# EAGLE schematic final_sdr (EAGLE 8.5.0)

## Sheet 1 of 2
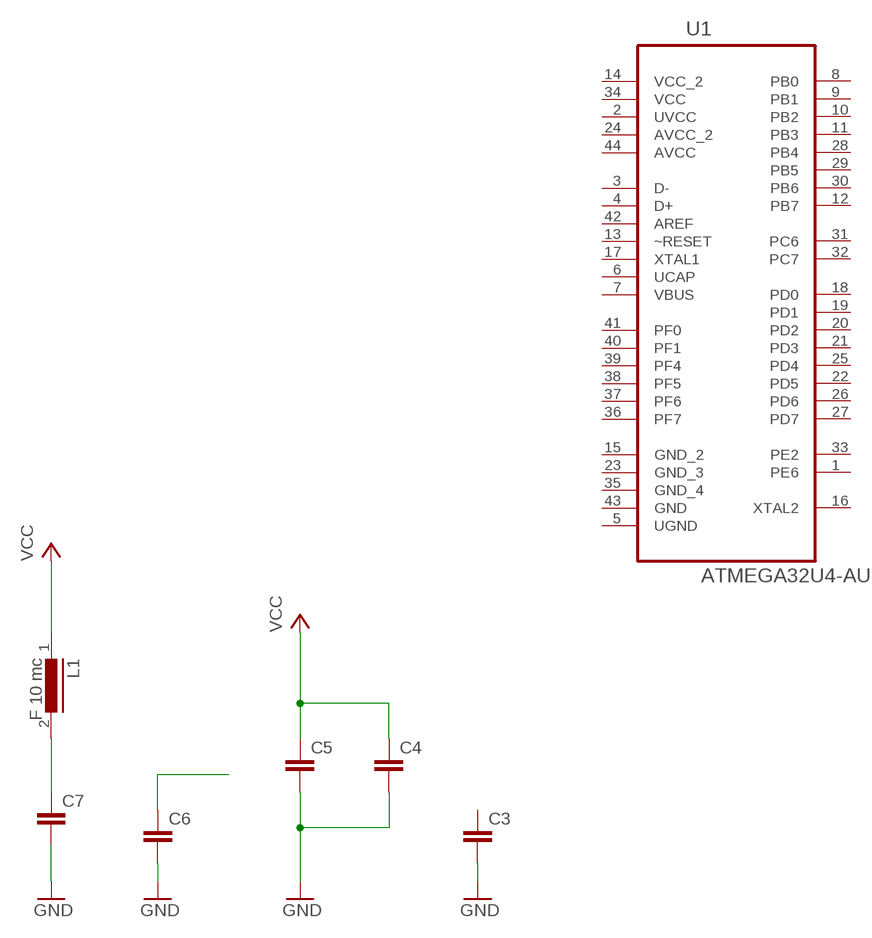
[diagram p0: schematic, sheet 1]

### Parts
C3  C2.5/2  [C2.5-2]
C4  C2.5/2  [C2.5-2]
C5  C2.5/2  [C2.5-2]
C6  C2.5/2  [C2.5-2]
C7  C2.5/2  [C2.5-2]
L1  F 10 mc  B825-35  [B825-35]
U1  ATMEGA32U4-AU  [QFP80P1200X1200X120-44N]

### Nets
GND: C3.2 C4.2 C5.2 C6.2 C7.2
N$1: C6.1
N$3: C7.1 L1.2
VCC: C4.1 C5.1 L1.1
Unconnected: C3.1 U1.1(PE6) U1.3(D-) U1.4(D+) U1.5(UGND) U1.7(VBUS) U1.8(PB0) U1.9(PB1) U1.10(PB2) U1.11(PB3) U1.12(PB7) U1.13(~RESET) U1.15(GND_2) U1.16(XTAL2) U1.17(XTAL1) U1.18(PD0) U1.19(PD1) U1.20(PD2) U1.21(PD3) U1.22(PD5) U1.23(GND_3) U1.25(PD4) U1.26(PD6) U1.27(PD7) U1.28(PB4) U1.29(PB5) U1.30(PB6) U1.31(PC6) U1.32(PC7) U1.33(PE2) U1.35(GND_4) U1.36(PF7) U1.37(PF6) U1.38(PF5) U1.39(PF4) U1.40(PF1) U1.41(PF0) U1.42(AREF) U1.43(GND)

## Sheet 2 of 2
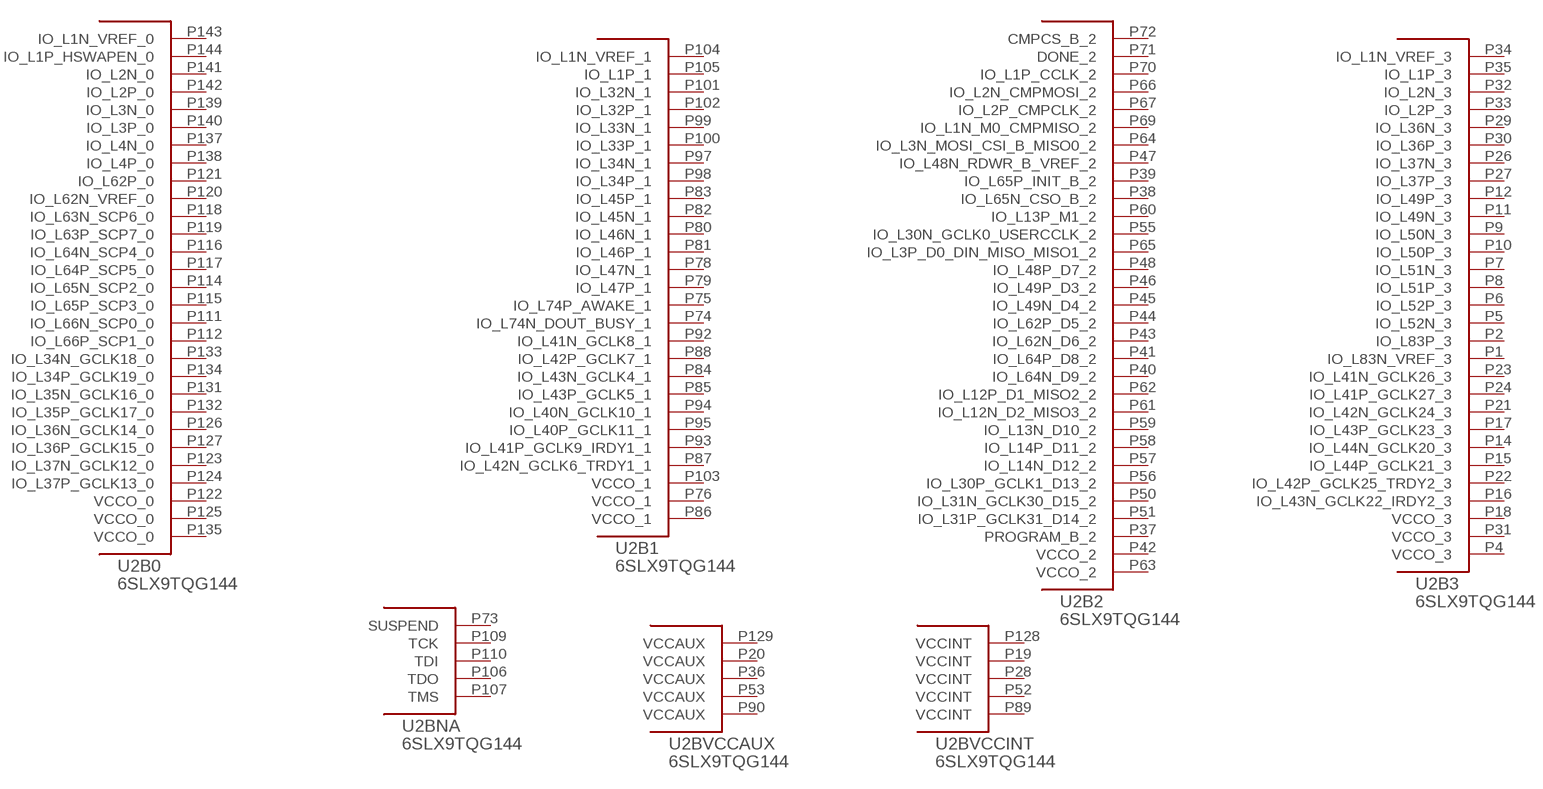
[diagram p1: schematic, sheet 2]

### Parts
U2  6SLX9TQG144  [TQ144]
Unconnected: U2.P1(B3:IO_L83N_VREF_3) U2.P2(B3:IO_L83P_3) U2.P4(B3:VCCO_3) U2.P5(B3:IO_L52N_3) U2.P6(B3:IO_L52P_3) U2.P7(B3:IO_L51N_3) U2.P8(B3:IO_L51P_3) U2.P9(B3:IO_L50N_3) U2.P10(B3:IO_L50P_3) U2.P11(B3:IO_L49N_3) U2.P12(B3:IO_L49P_3) U2.P14(B3:IO_L44N_GCLK20_3) U2.P15(B3:IO_L44P_GCLK21_3) U2.P16(B3:IO_L43N_GCLK22_IRDY2_3) U2.P17(B3:IO_L43P_GCLK23_3) U2.P18(B3:VCCO_3) U2.P19(BVCCINT:VCCINT) U2.P20(BVCCAUX:VCCAUX) U2.P21(B3:IO_L42N_GCLK24_3) U2.P22(B3:IO_L42P_GCLK25_TRDY2_3) U2.P23(B3:IO_L41N_GCLK26_3) U2.P24(B3:IO_L41P_GCLK27_3) U2.P26(B3:IO_L37N_3) U2.P27(B3:IO_L37P_3) U2.P28(BVCCINT:VCCINT) U2.P29(B3:IO_L36N_3) U2.P30(B3:IO_L36P_3) U2.P31(B3:VCCO_3) U2.P32(B3:IO_L2N_3) U2.P33(B3:IO_L2P_3) U2.P34(B3:IO_L1N_VREF_3) U2.P35(B3:IO_L1P_3) U2.P36(BVCCAUX:VCCAUX) U2.P37(B2:PROGRAM_B_2) U2.P38(B2:IO_L65N_CSO_B_2) U2.P39(B2:IO_L65P_INIT_B_2) U2.P40(B2:IO_L64N_D9_2) U2.P41(B2:IO_L64P_D8_2) U2.P42(B2:VCCO_2) U2.P43(B2:IO_L62N_D6_2) U2.P44(B2:IO_L62P_D5_2) U2.P45(B2:IO_L49N_D4_2) U2.P46(B2:IO_L49P_D3_2) U2.P47(B2:IO_L48N_RDWR_B_VREF_2) U2.P48(B2:IO_L48P_D7_2) U2.P50(B2:IO_L31N_GCLK30_D15_2) U2.P51(B2:IO_L31P_GCLK31_D14_2) U2.P52(BVCCINT:VCCINT) U2.P53(BVCCAUX:VCCAUX) U2.P55(B2:IO_L30N_GCLK0_USERCCLK_2) U2.P56(B2:IO_L30P_GCLK1_D13_2) U2.P57(B2:IO_L14N_D12_2) U2.P58(B2:IO_L14P_D11_2) U2.P59(B2:IO_L13N_D10_2) U2.P60(B2:IO_L13P_M1_2) U2.P61(B2:IO_L12N_D2_MISO3_2) U2.P62(B2:IO_L12P_D1_MISO2_2) U2.P63(B2:VCCO_2) U2.P64(B2:IO_L3N_MOSI_CSI_B_MISO0_2) U2.P65(B2:IO_L3P_D0_DIN_MISO_MISO1_2) U2.P66(B2:IO_L2N_CMPMOSI_2) U2.P67(B2:IO_L2P_CMPCLK_2) U2.P69(B2:IO_L1N_M0_CMPMISO_2) U2.P70(B2:IO_L1P_CCLK_2) U2.P71(B2:DONE_2) U2.P72(B2:CMPCS_B_2) U2.P73(BNA:SUSPEND) U2.P74(B1:IO_L74N_DOUT_BUSY_1) U2.P75(B1:IO_L74P_AWAKE_1) U2.P76(B1:VCCO_1) U2.P78(B1:IO_L47N_1) U2.P79(B1:IO_L47P_1) U2.P80(B1:IO_L46N_1) U2.P81(B1:IO_L46P_1) U2.P82(B1:IO_L45N_1) U2.P83(B1:IO_L45P_1) U2.P84(B1:IO_L43N_GCLK4_1) U2.P85(B1:IO_L43P_GCLK5_1) U2.P86(B1:VCCO_1) U2.P87(B1:IO_L42N_GCLK6_TRDY1_1) U2.P88(B1:IO_L42P_GCLK7_1) U2.P89(BVCCINT:VCCINT) U2.P90(BVCCAUX:VCCAUX) U2.P92(B1:IO_L41N_GCLK8_1) U2.P93(B1:IO_L41P_GCLK9_IRDY1_1) U2.P94(B1:IO_L40N_GCLK10_1) U2.P95(B1:IO_L40P_GCLK11_1) U2.P97(B1:IO_L34N_1) U2.P98(B1:IO_L34P_1) U2.P99(B1:IO_L33N_1) U2.P100(B1:IO_L33P_1) U2.P101(B1:IO_L32N_1) U2.P102(B1:IO_L32P_1) U2.P103(B1:VCCO_1) U2.P104(B1:IO_L1N_VREF_1) U2.P105(B1:IO_L1P_1) U2.P106(BNA:TDO) U2.P107(BNA:TMS) U2.P109(BNA:TCK) U2.P110(BNA:TDI) U2.P111(B0:IO_L66N_SCP0_0) U2.P112(B0:IO_L66P_SCP1_0) U2.P114(B0:IO_L65N_SCP2_0) U2.P115(B0:IO_L65P_SCP3_0) U2.P116(B0:IO_L64N_SCP4_0) U2.P117(B0:IO_L64P_SCP5_0) U2.P118(B0:IO_L63N_SCP6_0) U2.P119(B0:IO_L63P_SCP7_0) U2.P120(B0:IO_L62N_VREF_0) U2.P121(B0:IO_L62P_0) U2.P122(B0:VCCO_0) U2.P123(B0:IO_L37N_GCLK12_0) U2.P124(B0:IO_L37P_GCLK13_0) U2.P125(B0:VCCO_0) U2.P126(B0:IO_L36N_GCLK14_0) U2.P127(B0:IO_L36P_GCLK15_0) U2.P128(BVCCINT:VCCINT) U2.P129(BVCCAUX:VCCAUX) U2.P131(B0:IO_L35N_GCLK16_0) U2.P132(B0:IO_L35P_GCLK17_0) U2.P133(B0:IO_L34N_GCLK18_0) U2.P134(B0:IO_L34P_GCLK19_0) U2.P135(B0:VCCO_0) U2.P137(B0:IO_L4N_0) U2.P138(B0:IO_L4P_0) U2.P139(B0:IO_L3N_0) U2.P140(B0:IO_L3P_0) U2.P141(B0:IO_L2N_0) U2.P142(B0:IO_L2P_0) U2.P143(B0:IO_L1N_VREF_0) U2.P144(B0:IO_L1P_HSWAPEN_0)

## Power pins joined to a net without a drawn wire
AVCC: U1.44(AVCC)
AVCC_2: U1.24(AVCC_2)
GND: U2.P3(BGND:GND) U2.P13(BGND:GND) U2.P25(BGND:GND) U2.P49(BGND:GND) U2.P54(BGND:GND) U2.P68(BGND:GND) U2.P77(BGND:GND) U2.P91(BGND:GND) U2.P96(BGND:GND) U2.P108(BGND:GND) U2.P113(BGND:GND) U2.P130(BGND:GND) U2.P136(BGND:GND)
UCAP: U1.6(UCAP)
UVCC: U1.2(UVCC)
VCC: U1.34(VCC)
VCC_2: U1.14(VCC_2)

## Library data of the parts
C3-C7 = capacitor-wima:C: CAPACITOR naming: grid - package width
L1 = inductors:B825-35: INDUCTOR; SPICEPREFIX: L
U1 = ATMEGA32U4-AU:ATMEGA32U4-AU: 8-bit Microcontroller with ISP Flash and USB Controller; AVAILABILITY: Good; DESCRIPTION: IC MCU 8BIT 32KB FLASH 44TQFP; MF: Microchip; MP: ATMEGA32U4-AU; PACKAGE: TQFP-44 Microchip; PRICE: 3.94 USD
U2 = xilinx_devices:6SLX9TQG144: Xilinx FPGA: 6slx9tqg144